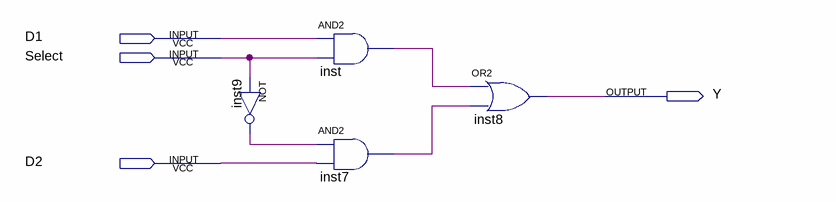
[diagram p0: schematic sheet]
// Quartus schematic MUX2to1.bdf as structural Verilog: 4 symbols, 4 pins
module MUX2to1 (
  input  D1,
  input  Select,
  input  D2,
  output Y
);

  wire inst7_out, inst9_out, inst_out;

  not inst9 (inst9_out, Select);
  and inst (inst_out, D1, Select);
  and inst7 (inst7_out, inst9_out, D2);
  or inst8 (Y, inst_out, inst7_out);
endmodule
